# Altium schematic sheet MegaD-328_7I7O_Shematic.SchDoc
size A4
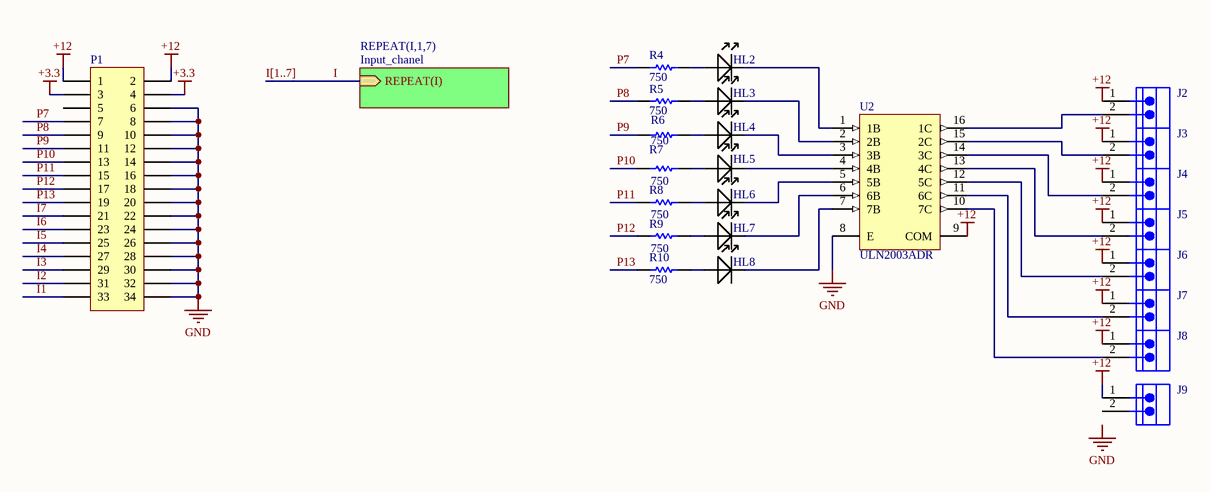
[diagram p0: MegaD-328_7I7O_Shematic.SchDoc]

## Parts
HL2  LED_SMD  [0805_LED]  (value not drawn)
HL3  LED_SMD  [0805_LED]  (value not drawn)
HL4  LED_SMD  [0805_LED]  (value not drawn)
HL5  LED_SMD  [0805_LED]  (value not drawn)
HL6  LED_SMD  [0805_LED]  (value not drawn)
HL7  LED_SMD  [0805_LED]  (value not drawn)
HL8  LED_SMD  [0805_LED]  (value not drawn)
J2  (no value)  [DG301-5.0-02P-1X]
J3  (no value)  [DG301-5.0-02P-1X]
J4  (no value)  [DG301-5.0-02P-1X]
J5  (no value)  [DG301-5.0-02P-1X]
J6  (no value)  [DG301-5.0-02P-1X]
J7  (no value)  [DG301-5.0-02P-1X]
J8  (no value)  [DG301-5.0-02P-1X]
J9  (no value)  [DG301-5.0-02P-1X]
P1  (no value)  [HDR2X17-PLC]
R4  Val: 750  [RES0805]  (hidden comment: RES_SMD)
R5  Val: 750  [RES0805]  (hidden comment: RES_SMD)
R6  Val: 750  [RES0805]  (hidden comment: RES_SMD)
R7  Val: 750  [RES0805]  (hidden comment: RES_SMD)
R8  Val: 750  [RES0805]  (hidden comment: RES_SMD)
R9  Val: 750  [RES0805]  (hidden comment: RES_SMD)
R10  Val: 750  [RES0805]  (hidden comment: RES_SMD)
U2  ULN2003ADR  [SO-16_L]

## Sub-sheets
REPEAT(I,1,7) = Input_chanel: REPEAT(I) (in)

## Nets
+3.3: P1.3 P1.4
+12: J2.1 J3.1 J4.1 J5.1 J6.1 J7.1 J8.1 J9.1 P1.1 P1.2 U2.9(COM)
GND: P1.6 P1.8 P1.10 P1.12 P1.14 P1.16 P1.18 P1.20 P1.22 P1.24 P1.26 P1.28 P1.30 P1.32 P1.34 U2.8(E)
I: sheet REPEAT(I,1,7)/REPEAT(I)
I1: P1.33
I2: P1.31
I3: P1.29
I4: P1.27
I5: P1.25
I6: P1.23
I7: P1.21
P7: P1.7 R4.1
P8: P1.9 R5.1
P9: P1.11 R6.1
P10: P1.13 R7.1
P11: P1.15 R8.1
P12: P1.17 R9.1
P13: P1.19 R10.1
NetHL2_1: HL2.1(anode) R4.2
NetHL2_2: HL2.2(cathode) U2.1(1B)
NetHL3_1: HL3.1(anode) R5.2
NetHL3_2: HL3.2(cathode) U2.2(2B)
NetHL4_1: HL4.1(anode) R6.2
NetHL4_2: HL4.2(cathode) U2.3(3B)
NetHL5_1: HL5.1(anode) R7.2
NetHL5_2: HL5.2(cathode) U2.4(4B)
NetHL6_1: HL6.1(anode) R8.2
NetHL6_2: HL6.2(cathode) U2.5(5B)
NetHL7_1: HL7.1(anode) R9.2
NetHL7_2: HL7.2(cathode) U2.6(6B)
NetHL8_1: HL8.1(anode) R10.2
NetHL8_2: HL8.2(cathode) U2.7(7B)
NetJ2_2: J2.2 U2.16(1C)
NetJ3_2: J3.2 U2.15(2C)
NetJ4_2: J4.2 U2.14(3C)
NetJ5_2: J5.2 U2.13(4C)
NetJ6_2: J6.2 U2.12(5C)
NetJ7_2: J7.2 U2.11(6C)
NetJ8_2: J8.2 U2.10(7C)

Not connected (* = marked no-connect by the designer): J9 2; P1 5

## Buses and harness runs
bus I[1..7]

## Notes on the sheet
- Labels drawn without touching a wire or pin: GND

## Library data of the parts
HL2-HL8 = LED_SMD: 0805 led
J2-J9 = Terminal_2: Euro Terminal Block, 6 A, 150 V, -40 to 105 degC, Pitch 2.54 mm, 1x2 Position, Height 8.6 mm, Tail Length 3.3 mm; Manufacturer: Cixi KaiFeng; PartNumber: KF120-02P-14; Rated Current: 6 A; Contact: Brass; Insulation Resistance: 5000 MOhm / 1000 V; Rated Voltage: 150 V; No. of Pole: 2; Withstanding Voltage: AC 1500 V / 1 Min; Contact Resistance: 20 mOhm; Pitch: Single Pitch; PackageReference: KF120-2; Color: Green; Mounting Technology: Through Hole; PackageDescription: Terminal Block, Pitch 2.54 mm, 1 x 2 Position, Height 8.6 mm, Tail Length 3.3 mm; ComponentLink2Description: Datasheet; ComponentLink1Description: Manufacturer URL; ComponentLink2URL: http://www.nb-kaifeng.com/upload/editor/ext_pdf/201305290533202245.pdf; Temp. Range: -40 to 105 degC; ComponentLink1URL: http://www.nb-kaifeng.com/
P1 = Header 17X2: Header, 17-Pin, Dual row; LatestRevisionDate: 17-Jul-2002; LatestRevisionNote: Re-released for DXP Platform.; Publisher: Altium Limited
U2 = ULN2003A: High-Voltage, High-Current Darlington Transistor Array, 0.5 A, 50 V, -20 to 70 degC, 16-Pin SOIC (D), Green (RoHS & no Sb/Br), Tape and Reel; Manufacturer: TexasInstruments; Peak DC Collector Current: 0.5A; Package Version: 4040047-6/M, 06/2011; Maximum Collector Emitter Voltage: 50V; Configuration: Array7; Maximum Collector Emitter Saturation Voltage: 1.1@100mA|1.3@200mA|1.6@350mAV; Rad Hard: No; Packaging: Tape&Reel; Datasheet URL: http://www.ti.com/general/docs/lit/getliterature.tsp?genericPartNumber=uln2003a&fileType=pdf; Package Reference: D16; Category: DarlingtonBJT; Datasheet Version: Rev. O, 01/2016; Manufacturer URL: http://www.ti.com/; Type: NPN; Package Description: 16-Pin Plastic Small Outline, Body 9.9 x 3.9 mm, Pitch 1.27 mm; Mounting: SurfaceMount; Package: 16SOIC; Package URL: http://www.ti.com/lit/ml/mpds178g/mpds178g.pdf